# Altium schematic sheet Cameras.SchDoc: =AM_Title
size A3; CompanyName: Antmicro Ltd; Address1: Zwierzyniecka 3; Address2: 60-813 Poznań; Address3: Poland; Address4: 60-813 Poznań, Poland; SheetNumber: 1; SheetTotal: 1; PageSetup: Record=PageOptions|CenterHorizontal=True|CenterVertical=True|PrintScale=0.97|XCorrection=1.00|YCorrection=1.00|PrintKind=1|BorderSize=5000000|LeftOffset=0|BottomOffset=0|Orientation=2|PaperLength=2970|PaperWidth=2100|Scale=100|PaperSource=7|PrintQuality=600|MediaType=1|DitherType=10|PaperKind=A4|PrintScaleMode=1
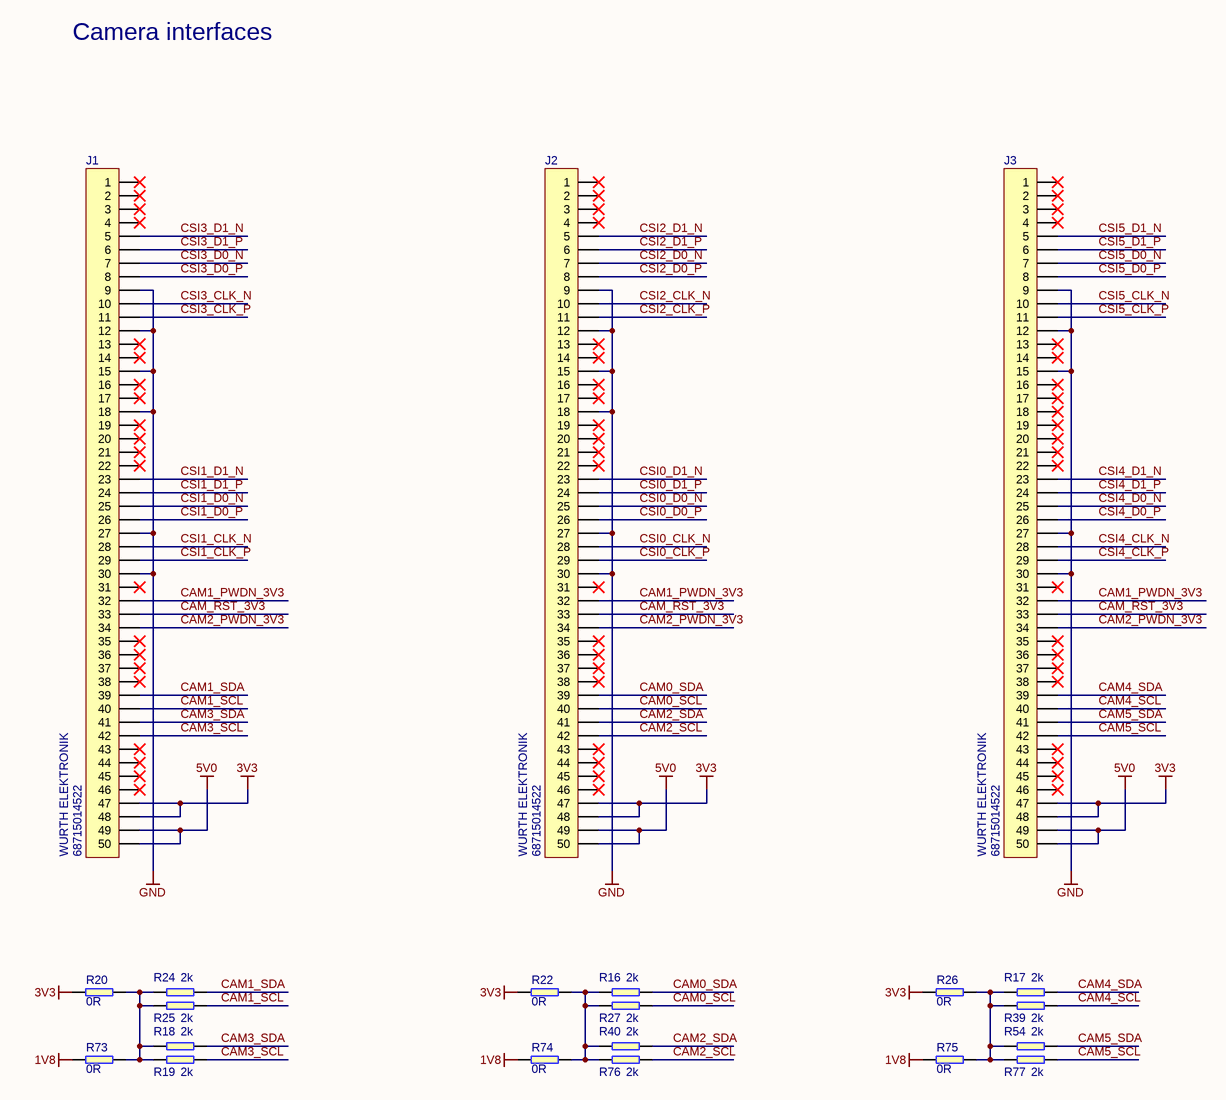
[diagram p0: Cameras.SchDoc]

## Parts
J1  68715014522  Manufacturer: WURTH ELEKTRONIK  [68715014522_FLIPPED]
J2  68715014522  Manufacturer: WURTH ELEKTRONIK  [68715014522_FLIPPED]
J3  68715014522  Manufacturer: WURTH ELEKTRONIK  [68715014522_FLIPPED]
R16  2k  [0603]
R17  2k  [0603]
R18  2k  [0603]
R19  2k  [0603]
R20  0R  [0603]
R22  0R  [0603]
R24  2k  [0603]
R25  2k  [0603]
R26  0R  [0603]
R27  2k  [0603]
R39  2k  [0603]
R40  2k  [0603]
R54  2k  [0603]
R73  0R  [0603]
R74  0R  [0603]
R75  0R  [0603]
R76  2k  [0603]
R77  2k  [0603]

## Nets
1V8: R73.1 R74.1 R75.1
3V3: J1.47 J1.48 J2.47 J2.48 J3.47 J3.48 R20.1 R22.1 R26.1
5V0: J1.49 J1.50 J2.49 J2.50 J3.49 J3.50
GND: J1.9 J1.12 J1.15 J1.18 J1.27 J1.30 J2.9 J2.12 J2.15 J2.18 J2.27 J2.30 J3.9 J3.12 J3.15 J3.27 J3.30
CAM0_SCL: J2.40 R27.1
CAM0_SDA: J2.39 R16.1
CAM1_PWDN_3V3: J1.32 J2.32 J3.32
CAM1_SCL: J1.40 R25.1
CAM1_SDA: J1.39 R24.1
CAM2_PWDN_3V3: J1.34 J2.34 J3.34
CAM2_SCL: J2.42 R76.1
CAM2_SDA: J2.41 R40.1
CAM3_SCL: J1.42 R19.1
CAM3_SDA: J1.41 R18.1
CAM4_SCL: J3.40 R39.1
CAM4_SDA: J3.39 R17.1
CAM5_SCL: J3.42 R77.1
CAM5_SDA: J3.41 R54.1
CAM_RST_3V3: J1.33 J2.33 J3.33
CSI0_CLK_N: J2.28
CSI0_CLK_P: J2.29
CSI0_D0_N: J2.25
CSI0_D0_P: J2.26
CSI0_D1_N: J2.23
CSI0_D1_P: J2.24
CSI1_CLK_N: J1.28
CSI1_CLK_P: J1.29
CSI1_D0_N: J1.25
CSI1_D0_P: J1.26
CSI1_D1_N: J1.23
CSI1_D1_P: J1.24
CSI2_CLK_N: J2.10
CSI2_CLK_P: J2.11
CSI2_D0_N: J2.7
CSI2_D0_P: J2.8
CSI2_D1_N: J2.5
CSI2_D1_P: J2.6
CSI3_CLK_N: J1.10
CSI3_CLK_P: J1.11
CSI3_D0_N: J1.7
CSI3_D0_P: J1.8
CSI3_D1_N: J1.5
CSI3_D1_P: J1.6
CSI4_CLK_N: J3.28
CSI4_CLK_P: J3.29
CSI4_D0_N: J3.25
CSI4_D0_P: J3.26
CSI4_D1_N: J3.23
CSI4_D1_P: J3.24
CSI5_CLK_N: J3.10
CSI5_CLK_P: J3.11
CSI5_D0_N: J3.7
CSI5_D0_P: J3.8
CSI5_D1_N: J3.5
CSI5_D1_P: J3.6
NetR16_2: R16.2 R22.2 R27.2 R40.2 R74.2 R76.2
NetR17_2: R17.2 R26.2 R39.2 R54.2 R75.2 R77.2
NetR18_2: R18.2 R19.2 R20.2 R24.2 R25.2 R73.2

Not connected (* = marked no-connect by the designer): J1 1* 2* 3* 4* 13* 14* 16* 17* 19* 20* 21* 22* 31* 35* 36* 37* 38* 43* 44* 45* 46*; J2 1* 2* 3* 4* 13* 14* 16* 17* 19* 20* 21* 22* 31* 35* 36* 37* 38* 43* 44* 45* 46*; J3 1* 2* 3* 4* 13* 14* 16* 17* 18* 19* 20* 21* 22* 31* 35* 36* 37* 38* 43* 44* 45* 46*

## Notes on the sheet
- Camera interfaces
- Title:
- Drawn by:
- Size:
- Date:
- Approved by:
- A3
- Revision:
- Page:
- of
- www.antmicro.com
- File:

## Library data of the parts
J1-J3 = WE-687-150-145-22_FLIPPED: 0.50mm SMT ZIF Horizontal Bottom Contact WR-FPC; Part Number: WE-687-150-145-22_FLIPPED; Supplier Part Number 1: 1908481; Value: 68715014522; Supplier 1: Farnell; Part Symbol: 68715014522
R16-R19 R24 R25 R27 R39 R40 R54 R76 R77 = R_2k_0603: SMT Resistor 2k 0603; Manufacturer: MULTICOMP; Part Symbol: MCMR06X2001FTL; Value: 2k; Part Number: R_2k_0603; Supplier 1: Farnell; Supplier Part Number 1: 2073418
R20 R22 R26 R73-R75 = R_0R_0603: SMT Resistor 0R 0603; Manufacturer: BOURNS; Part Symbol: CR0603-J/-000ELF; Tolerance: 5%; Part Number: R_0R_0603; Value: 0R; Supplier 1: Farnell; Supplier Part Number 1: 2008343